# EAGLE design untitled (EAGLE 7.2.0)
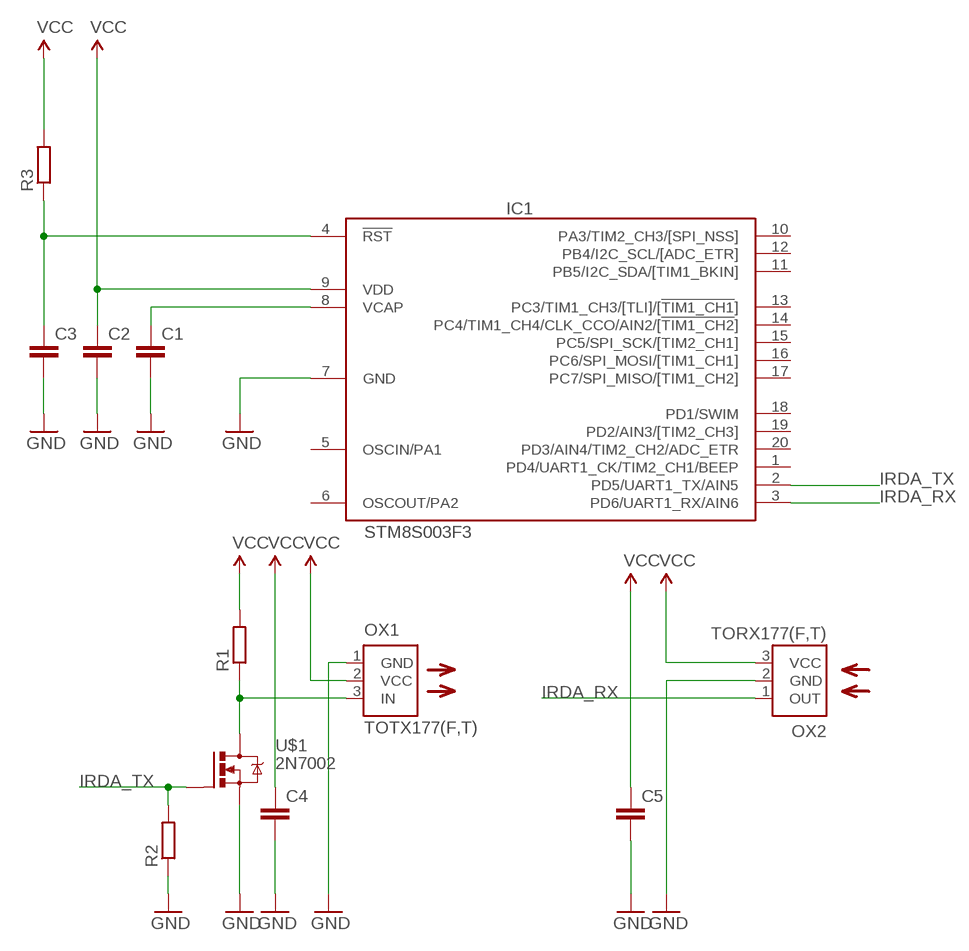
[diagram p0: schematic, sheet 1]

## Parts
C1  CC0805  [C0805]
C2  CC0805  [C0805]
C3  CC0603  [C0603]
C4  CC0805  [C0805]
C5  CC0805  [C0805]
IC1  STM8S003F3  [TSSOP20]
OX1  TOTX177(F,T)  [TOTX]
OX2  TORX177(F,T)  [TORX]
R1  R0603  [0603]
R2  R0603  [0603]
R3  R0603  [0603]
U$1  2N7002  [SOT23]

## Nets
GND: C1.2 C2.2 C3.2 C4.2 C5.2 IC1.7(GND) OX1.1(GND) OX2.2(GND) R2.1 U$1.2(S)
IRDA_RX: IC1.3(PD6/UART1_RX/AIN6) OX2.1(OUT)
IRDA_TX: IC1.2(PD5/UART1_TX/AIN5) R2.2 U$1.1(G)
N$1: C1.1 IC1.8(VCAP)
N$2: OX1.3(IN) R1.1 U$1.3(D)
N$4: C3.1 IC1.4(!RST) R3.1
VCC: C2.1 C4.1 C5.1 IC1.9(VDD) OX1.2(VCC) OX2.3(VCC) R1.2 R3.2
Unconnected: IC1.1(PD4/UART1_CK/TIM2_CH1/BEEP) IC1.5(OSCIN/PA1) IC1.6(OSCOUT/PA2) IC1.10(PA3/TIM2_CH3/[SPI_NSS]) IC1.11(PB5/I2C_SDA/[TIM1_BKIN]) IC1.12(PB4/I2C_SCL/[ADC_ETR]) IC1.13(PC3/TIM1_CH3/[TLI]/[!TIM1_CH1!]) IC1.14(PC4/TIM1_CH4/CLK_CCO/AIN2/[!TIM1_CH2!]) IC1.15(PC5/SPI_SCK/[TIM2_CH1]) IC1.16(PC6/SPI_MOSI/[TIM1_CH1]) IC1.17(PC7/SPI_MISO/[TIM1_CH2]) IC1.18(PD1/SWIM) IC1.19(PD2/AIN3/[TIM2_CH3]) IC1.20(PD3/AIN4/TIM2_CH2/ADC_ETR)

## Library data of the parts
C1-C5 = CasaLibrary:C: Capacitor
IC1 = CasaLibrary:STM8S003: Value line, 16 MHz STM8S 8-bit MCU, 8 Kbytes Flash, 128 bytes data EEPROM, 10-bit ADC, 3 timers, UART, SPI, I2C
OX1 = CasaLibrary:TOTX177(F,T): FIBER OPTIC TRANSMITTING MODULE
OX2 = CasaLibrary:TORX177(F,T): FIBER OPTIC RECEIVING MODULE
R1-R3 = CasaLibrary:R
U$1 = CasaLibrary:2N7002

## Board
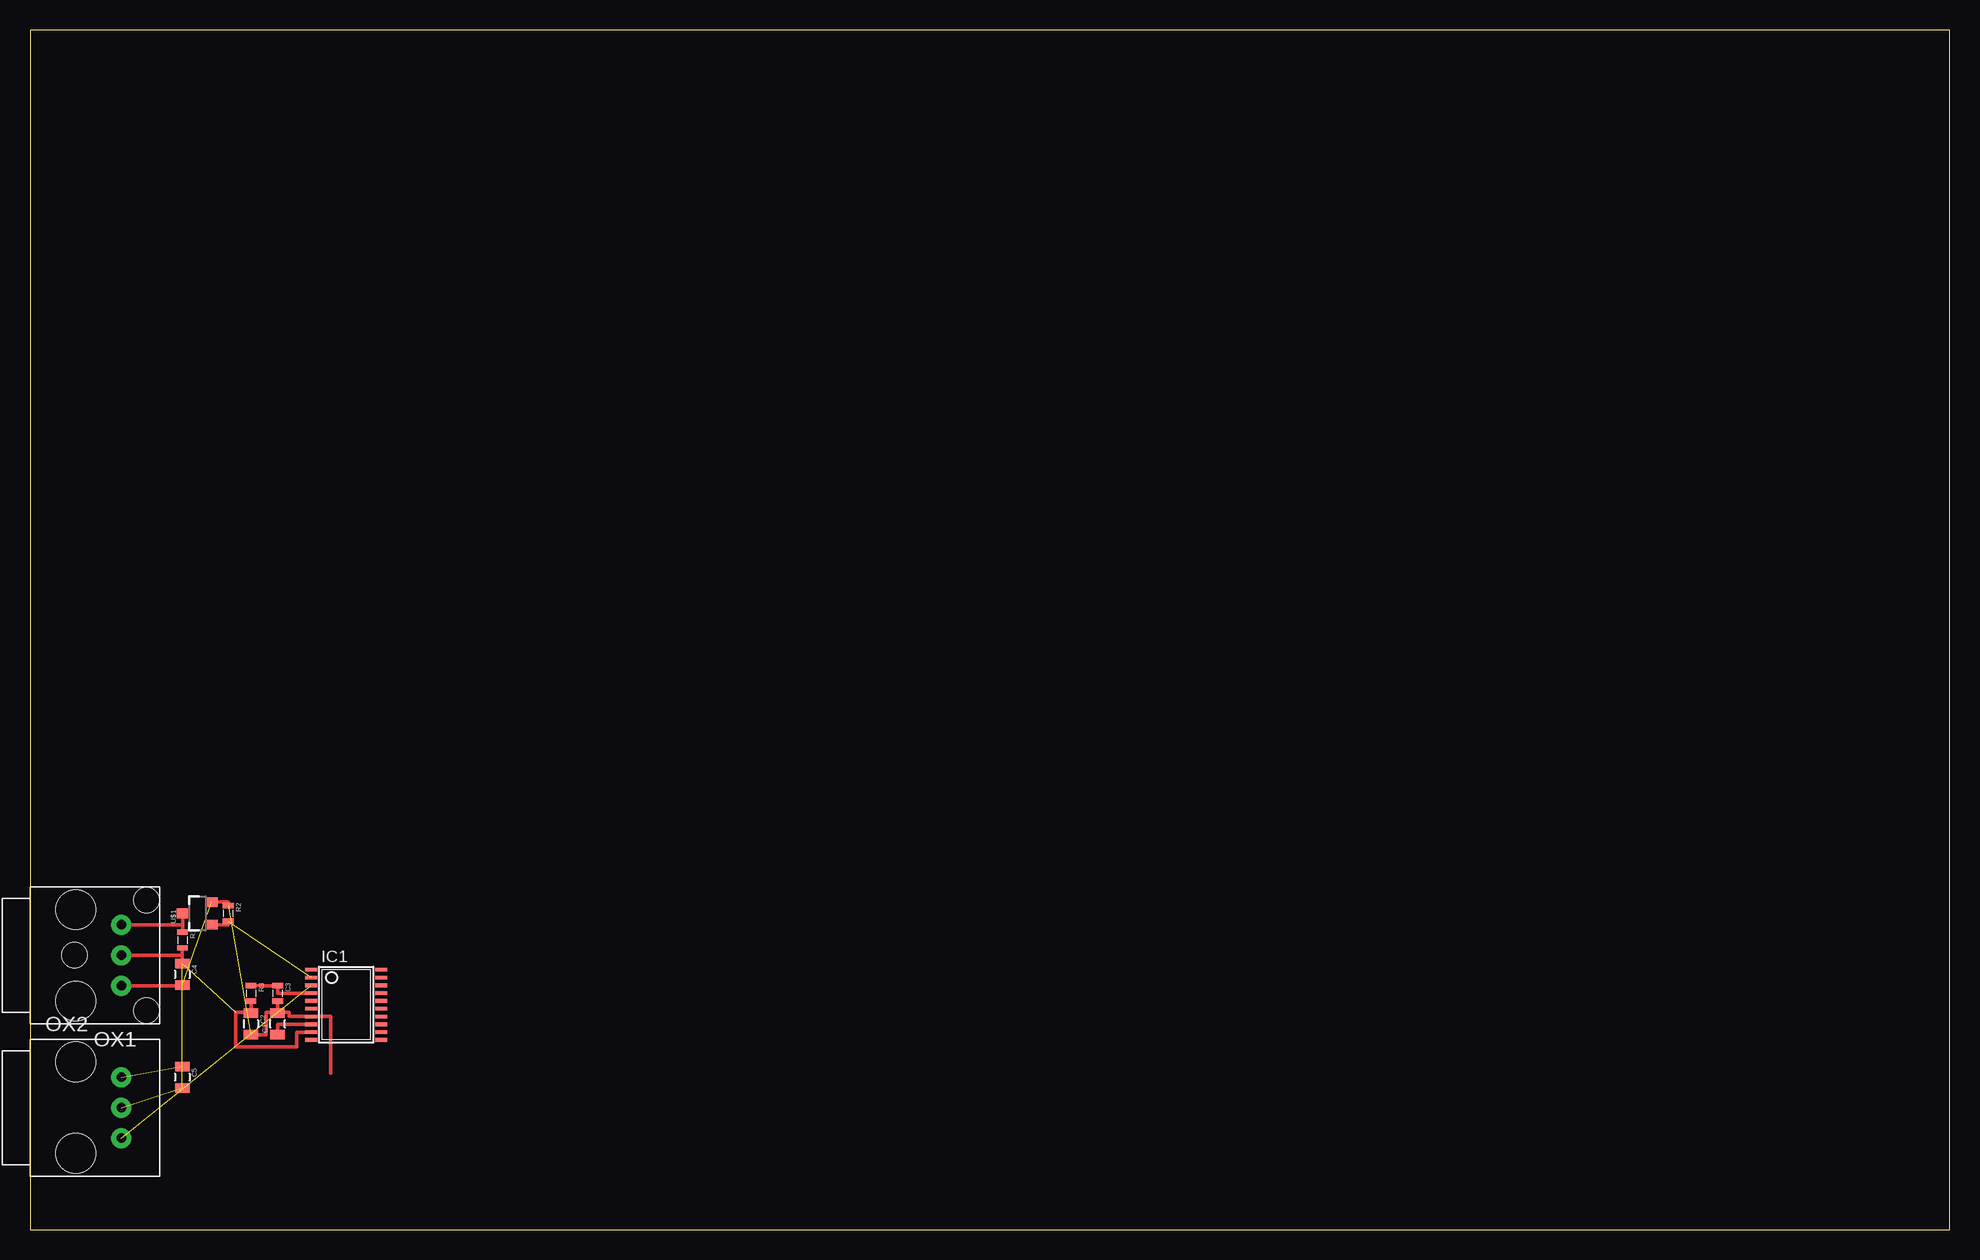
[diagram p1: board, top side]

Size 160 x 100 mm. Coordinates in mm from the lower left corner, seen from the top.
Outline: 0,0 160,0 160,100 0,100 0,0
Copper layers (1*16): Top 0.035mm / dielectric 1.5mm / Bottom 0.035mm
Design rules "default": minimum track width 0.2mm, minimum drill 0.2mm, track to track 0.2mm, track to pad 0.2mm, pad to pad 0.2mm, via to via 0.2mm, smd to smd 0.2mm, copper to edge 0.2mm, drill to drill 0.2mm, minimum pad ring 10mil, minimum via ring 8mil, stop-mask expansion 4mil, vias tented up to drill 0mil, thermal gap 10mil

### Footprints (pad centres in the part's own frame; a part is rotated, then mirrored left to right if it is on the bottom)
C0805 = smd 0.8 x 1.2: 1 -0.9,0; 2 0.9,0
C0603 = smd 0.45 x 0.9: 1 -0.65,0; 2 0.65,0
TSSOP20 = smd 0.305 x 0.991: 1 -2.925,-2.918; 2 -2.275,-2.918; 3 -1.625,-2.918; 4 -0.975,-2.918; 5 -0.325,-2.918; 6 0.325,-2.918; 7 0.975,-2.918; 8 1.625,-2.918; 9 2.275,-2.918; 10 2.925,-2.918; 11 2.925,2.918; 12 2.275,2.918; 13 1.625,2.918; 14 0.975,2.918; 15 0.325,2.918; 16 -0.325,2.918; 17 -0.975,2.918; 18 -1.625,2.918; 19 -2.275,2.918; 20 -2.925,2.918
TOTX = drill 0.8 pad 1.676: 1 -3.81,2.54; 2 -3.81,0; 3 -3.81,-2.54 | hole 3.3: 0,-3.81; 0,3.81 | hole 2.1: 0.09,0; -5.91,4.6; -5.91,-4.6
TORX = drill 0.8 pad 1.676: 1 3.81,-2.54; 2 3.81,0; 3 3.81,2.54 | hole 3.3: 0,3.81; 0,-3.81
0603 = smd 0.45 x 0.9: 1 -0.65,0; 2 0.65,0
SOT23 = smd 0.8 x 1: 1 -0.95,-1.159; 2 0.95,-1.159; 3 0,1.259

### Placement (x,y rotation side)
C1  20.64,17.14 90 top
C2  18.41,17.14 270 top
C3  20.64,19.68 270 top
C4  12.7,21.27 270 top
C5  12.7,12.7 270 top
IC1  26.35,18.73 270 top
OX1  3.81,22.86 180 top
OX2  3.81,10.16 0 top
R1  12.7,24.13 270 top
R2  16.51,26.35 270 top
R3  18.41,19.68 270 top
U$1  13.97,26.35 90 top

### Tracks (layer width: path | path; a pad name or v marks a point on that pad's centre or on a via)
GND  (4 unrouted)
  Top 0.305: C2.2 19.68,16.25 19.68,18.1 20.64,18.1 | C3.2 C1.2 20.64,18.1 | 20.64,18.1 21.59,18.1 21.59,17.76 IC1.7 25.08,17.76 25.08,13.02 | OX1.1 12.7,20.32 C4.2 | U$1.2 16.51,27.3 R2.1
IRDA_RX  (1 unrouted)
IRDA_TX  (1 unrouted)
  Top 0.305: U$1.1 16.51,25.4 R2.2
N$1
  Top 0.305: IC1.8 20.64,17.11 C1.1
N$2
  Top 0.305: R1.1 12.71,24.78 12.71,25.4 | 12.71,25.4 U$1.3 | OX1.3 12.71,25.4
N$4
  Top 0.305: IC1.4 20.64,19.71 C3.1 | C3.1 20.95,20.32 C3.1 | C3.1 19.37,20.32 R3.1
VCC  (3 unrouted)
  Top 0.305: R3.2 18.47,19.04 C2.1 18.41,18.1 17.14,18.1 17.14,15.24 22.23,15.24 22.23,16.46 IC1.9 | R1.2 12.7,22.86 | 12.7,22.86 C4.1 | OX1.2 12.7,22.86